# Altium schematic sheet Due.SchDoc
size A4
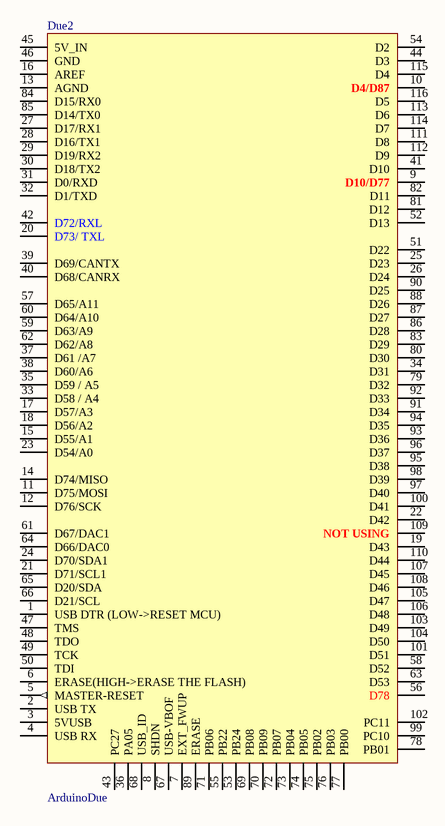
[diagram p0: Due.SchDoc]

## Parts
Due2  ArduinoDue  [DUE_MODULE]

## Nets

Not connected (* = marked no-connect by the designer): Due2 1(USB_DTR_(LOW->RESET_MCU)) 2(USB_TX) 3(5VUSB) 4(USB_RX) 5(MASTER-RESET) 6(ERASE(HIGH->ERASE_THE_FLASH)) 7(EXT_FWUP) 8(SHDN) 9(D10/D77) 10(D4/D87) 11(D75/MOSI) 12(D76/SCK_) 13(AGND) 14(D74/MISO) 15(D55/A1) 16(AREF) 17(D57/A3) 18(D56/A2) 19(D43) 20(D73/_TXL) 21(D71/SCL1) 22(D42) 23(D54/A0) 24(D70/SDA1) 25(D23) 26(D24) 27(D17/RX1) 28(D16/TX1) 29(D19/RX2) 30(D18/TX2) 31(D0/RXD) 32(D1/TXD) 33(D58_/_A4) 34(D31) 35(D59_/_A5) 36(PA05) 37(D61_/A7_) 38(D60/A6) 39(D69/CANTX) 40(D68/CANRX) 41(D10) 42(D72/RXL) 43(PC27) 44(D3) 45(5V_IN) 46(GND) 47(TMS) 48(TDO) 49(TCK) 50(TDI) 51(D22) 52(D13) 53(PB24) 54(D2) 55(PB22) 56(D78) 57(D65/A11) 58(D52) 59(D63/A9) 60(D64/A10) 61(D67/DAC1) 62(D62/A8) 63(D53) 64(D66/DAC0) 65(D20/SDA) 66(D21/SCL) 67(USB-VBOF) 68(USB_ID) 69(PB08) 70(PB09) 71(PB06) 72(PB07) 73(PB04) 74(PB05) 75(PB02) 76(PB03) 77(PB00) 78(PB01) 79(D32) 80(D30) 81(D12) 82(D11) 83(D29) 84(D15/RX0) 85(D14/TX0) 86(D28) 87(D27) 88(D26) 89(ERASE) 90(D25) 91(D34) 92(D33) 93(D36) 94(D35) 95(D38) 96(D37) 97(D40) 98(D39) 99(PC10) 100(D41) 101(D51) 102(PC11) 103(D49) 104(D50) 105(D47) 106(D48) 107(D45) 108(D46) 109(NOT_USING) 110(D44) 111(D8) 112(D9) 113(D6) 114(D7) 115(D4) 116(D5)

## Library data of the parts
Due2 = ArduinoDue: ComponentLink1Description: Buy; ComponentLink1URL: http://www.inhaos.com/product_info.php?products_id=164